# EAGLE design calbi (EAGLE 7.5.0)
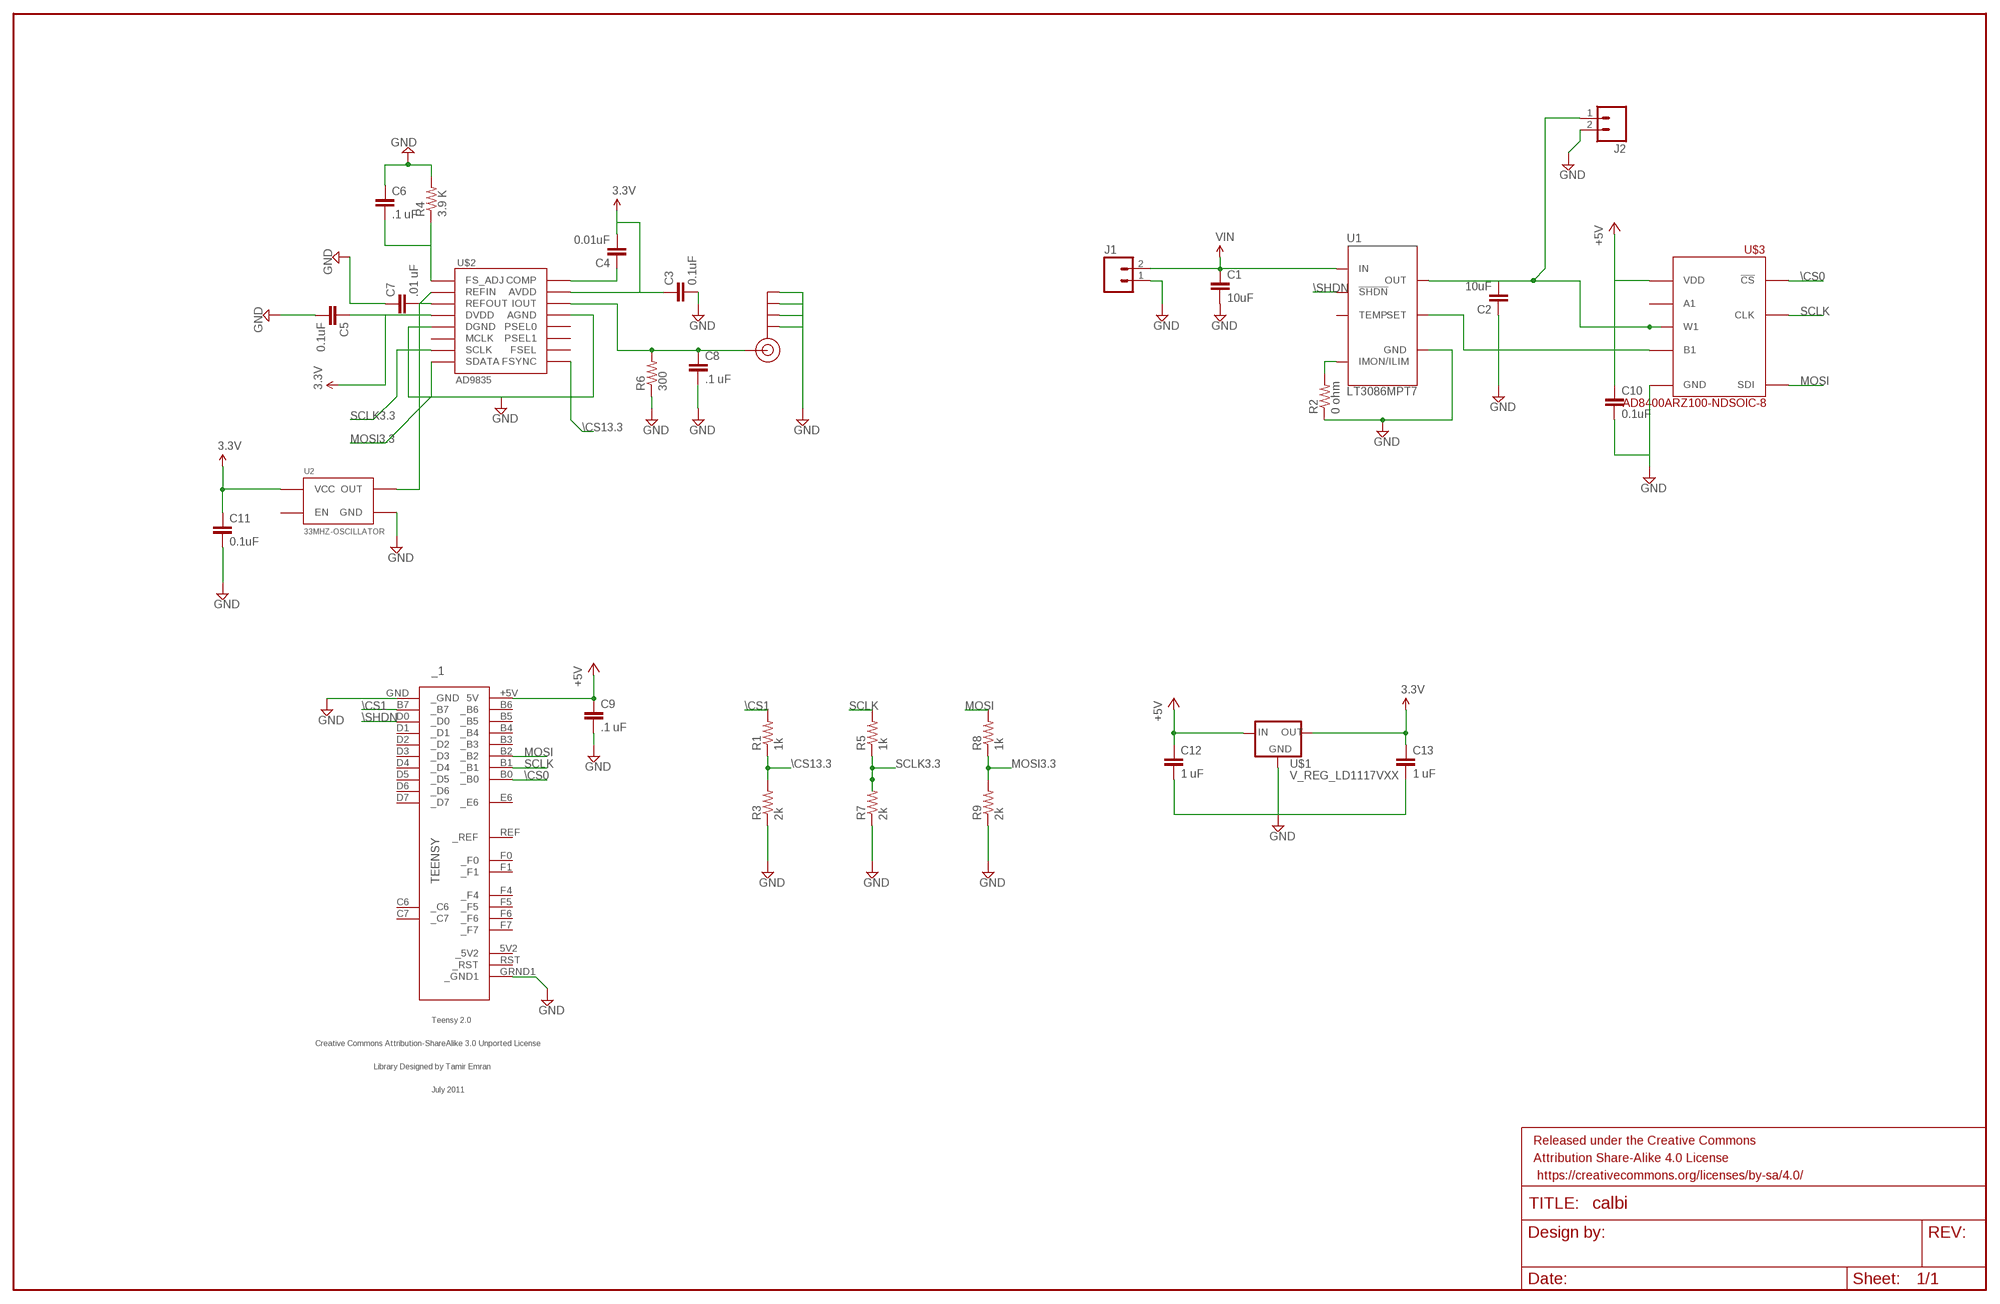
[diagram p0: schematic, sheet 1]

## Parts
_1  TEENSY  [TEENSY]
C1  10uF  CAP0603-CAP  [0603-CAP]
C2  10uF  CAP0603-CAP  [0603-CAP]
C3  0.1uF  CAP0603-CAP  [0603-CAP]
C4  0.01uF  CAP0603-CAP  [0603-CAP]
C5  0.1uF  CAP0603-CAP  [0603-CAP]
C6  .1 uF  CAP0603-CAP  [0603-CAP]
C7  .01 uF  CAP0603-CAP  [0603-CAP]
C8  .1 uF  CAP0603-CAP  [0603-CAP]
C9  .1 uF  CAP0603-CAP  [0603-CAP]
C10  0.1uF  CAP0603-CAP  [0603-CAP]
C11  0.1uF  CAP0603-CAP  [0603-CAP]
C12  1 uF  CAP0603-CAP  [0603-CAP]
C13  1 uF  CAP0603-CAP  [0603-CAP]
FRAME1  FRAME-LEDGER  [CREATIVE_COMMONS]
J1  M023.5MM  [SCREWTERMINAL-3.5MM-2]
J2  M023.5MM  [SCREWTERMINAL-3.5MM-2]
J$1  SMA_EDGE  [SMA-EDGE]
R1  1k  RESISTOR0603-RES  [0603-RES]
R2  0 ohm  RESISTOR0603-RES  [0603-RES]
R3  2k  RESISTOR0603-RES  [0603-RES]
R4  3.9 K  RESISTOR0603-RES  [0603-RES]
R5  1k  RESISTOR0603-RES  [0603-RES]
R6  300  RESISTOR0603-RES  [0603-RES]
R7  2k  RESISTOR0603-RES  [0603-RES]
R8  1k  RESISTOR0603-RES  [0603-RES]
R9  2k  RESISTOR0603-RES  [0603-RES]
U1  LT3086MPT7  [TO220-7]
U2  33MHZ-OSCILLATOR  [CRYSTAL-OSC-SMD-5X3.2]
U$1  V_REG_LD1117VXX  [78XXL]
U$2  AD9835  [TSSOP16]
U$3  AD8400ARZ100-NDSOIC-8  [SO08]

## Nets
3.3V: C3.1 C4.2 C5.1 C11.1 C13.1 U2.4(VCC) U$1.GND(OUT) U$2.4(DVDD) U$2.15(AVDD)
+5V: _1.+5V(5V) C9.1 C10.1 C12.1 U$1.OUT(IN) U$3.6(VDD)
\CS0: _1.B0(_B0) U$3.3(!CS)
\CS1: _1.B7(_B7) R1.2
\CS13.3: R1.1 R3.2 U$2.9(FSYNC)
\SHDN: _1.D0(_D0) U1.6(!SHDN)
GND: _1.GND(_GND) _1.GRND1(_GND1) C1.2 C2.1 C3.2 C5.2 C6.1 C7.1 C8.2 C9.2 C10.2 C11.2 C12.2 C13.2 J1.1 J2.2 J$1.GND@0(GND) J$1.GND@1(GND) J$1.GND@2(GND) J$1.GND@3(GND) R2.1 R3.1 R4.2 R6.1 R7.1 R9.1 U1.4(GND) U2.2(GND) U$1.IN(GND) U$2.5(DGND) U$2.13(AGND) U$3.2(GND)
MOSI: _1.B2(_B2) R8.2 U$3.4(SDI)
MOSI3.3: R8.1 R9.2 U$2.8(SDATA)
N$1: C7.2 U$2.3(REFOUT)
N$2: R2.2 U1.1(IMON/ILIM)
N$3: C8.1 J$1.SIG(SIGNAL) R6.2 U$2.14(IOUT)
N$4: C4.1 U$2.16(COMP)
N$5: C2.2 J2.1 U1.3(OUT) U$3.7(W1)
N$6: U2.3(OUT) U$2.2(REFIN)
N$7: C6.2 R4.1 U$2.1(FS_ADJ)
N$8: C1.1 J1.2 U1.5(IN)
N$10: U1.2(SET) U$3.1(B1)
SCLK: _1.B1(_B1) R5.2 U$3.5(CLK)
SCLK3.3: R5.1 R7.2 U$2.7(SCLK)
Unconnected: _1.5V2(_5V2) _1.B3(_B3) _1.B4(_B4) _1.B5(_B5) _1.B6(_B6) _1.C6(_C6) _1.C7(_C7) _1.D1(_D1) _1.D2(_D2) _1.D3(_D3) _1.D4(_D4) _1.D5(_D5) _1.D6(_D6) _1.D7(_D7) _1.E6(_E6) _1.F0(_F0) _1.F1(_F1) _1.F4(_F4) _1.F5(_F5) _1.F6(_F6) _1.F7(_F7) _1.REF(_REF) _1.RST(_RST) U1.7(TEMP) U2.1(EN) U$2.6(MCLK) U$2.10(FSEL) U$2.11(PSEL1) U$2.12(PSEL0) U$3.8(A1)

## Library data of the parts
_1 = calbi:TEENSY: Teensy 2.0 Original Design by Clint Fisher Modified Design by Tamir Emran Licensed Under Creative Commons Attribution-ShareAlike 3.0 Unported (CC BY-SA 3.0)
C1-C13 = SparkFun-Capacitors:CAP: Capacitor Standard 0603 ceramic capacitor, and 0.1" leaded capacitor.
FRAME1 = SparkFun-Aesthetics:FRAME-LEDGER: Schematic Frame Standard 11x14 US Ledger frame
J1 J2 = SparkFun-Connectors:M02: Standard 2-pin 0.1" header. Use with - straight break away headers ( PRT-00116) - right angle break away headers (PRT-00553) - swiss pins (PRT-00743) - machine pins (PRT-00117) - female headers (PRT-00115) Molex polarized connector foot print use with: PRT-08233 with associated crimp pins and housings. 2.54_SCREWTERM for use with PRT-10571. 3.5mm Screw Terminal footprints for PRT-08084 5mm Screw Terminal footprints for use with PRT-08432; PROD_ID: CONN-08399
J$1 = SparkFun-Connectors:SMA_EDGE: SMA Antenna Connector End launch SMA connector. The paste layer has been removed so that the connector can be hand soldered onto the board after reflow.
R1-R9 = SparkFun-Passives:RESISTOR: Resistor Basic schematic elements and footprints for 0603, 1206, and PTH resistors.
U1 = calbi:LT3086MPT7: The LT3086MPT7 is a 40V, 2.1A Low Dropout adjustable linear regulator with monitoring and cable drop compensation
U2 = SparkFun-FreqCtrl:33MHZ-OSCILLATOR: Generic 5x3.2 Oscillator; PROD_ID: XTAL-11986
U$1 = SparkFun-PowerIC:V_REG_LD1117VXX: LD1117VXX voltage regulator. We carry the 3.3V version (COM-00526) in TO-220 package.
U$2 = calbi:AD9835: 50MHz DDS waveform generator
U$3 = calbi:AD8400ARZ100-ND: The AD8400ARZ100-ND is a 1-channel digital potentiometer. This device provides a single variable resistor in SOIC-8 package up to 100K resistance

## Board
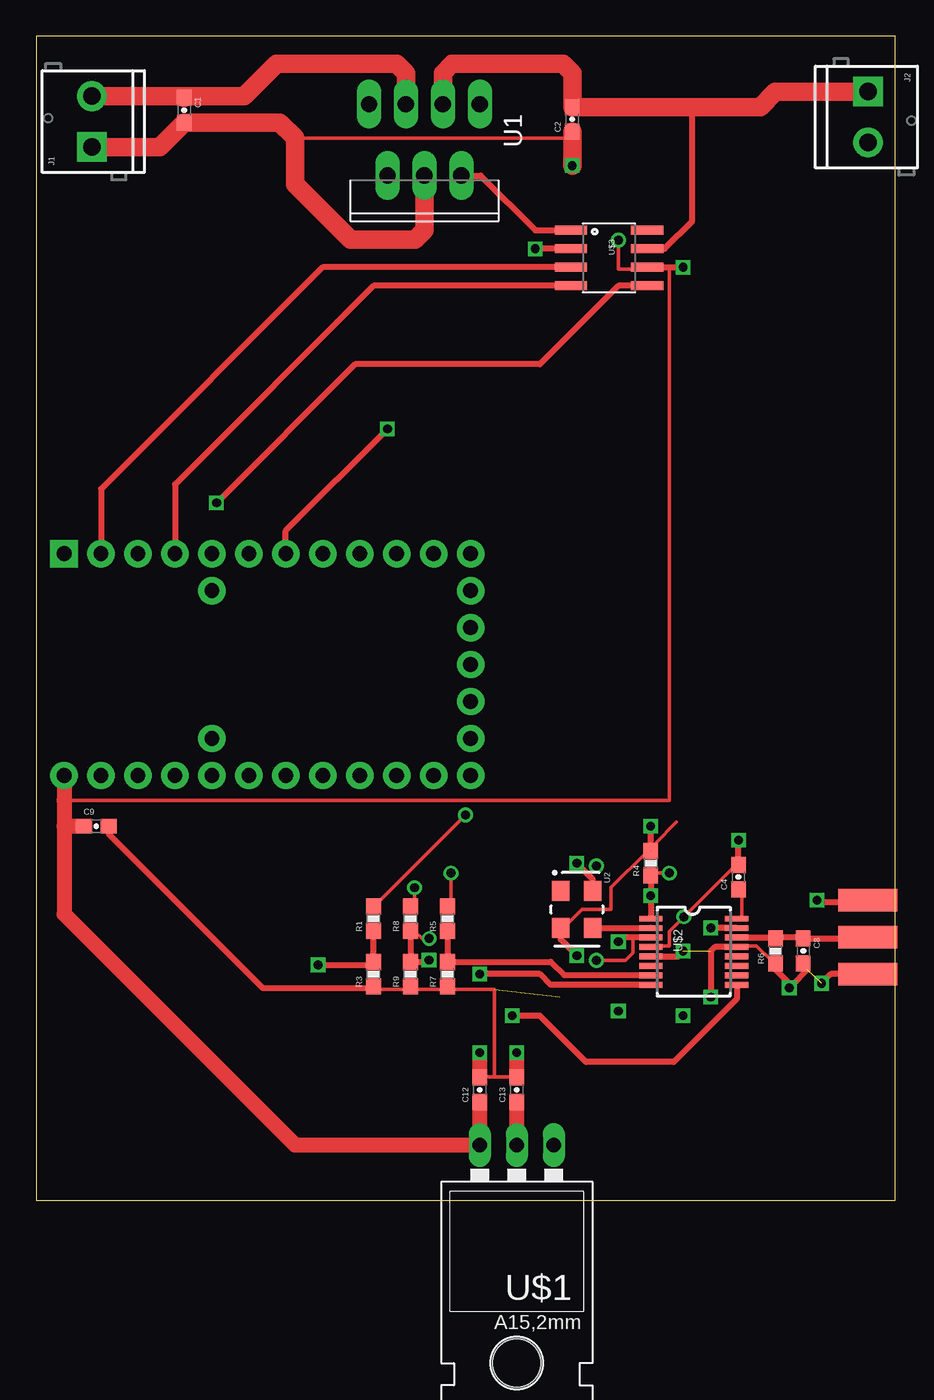
[diagram p1: board, top side]
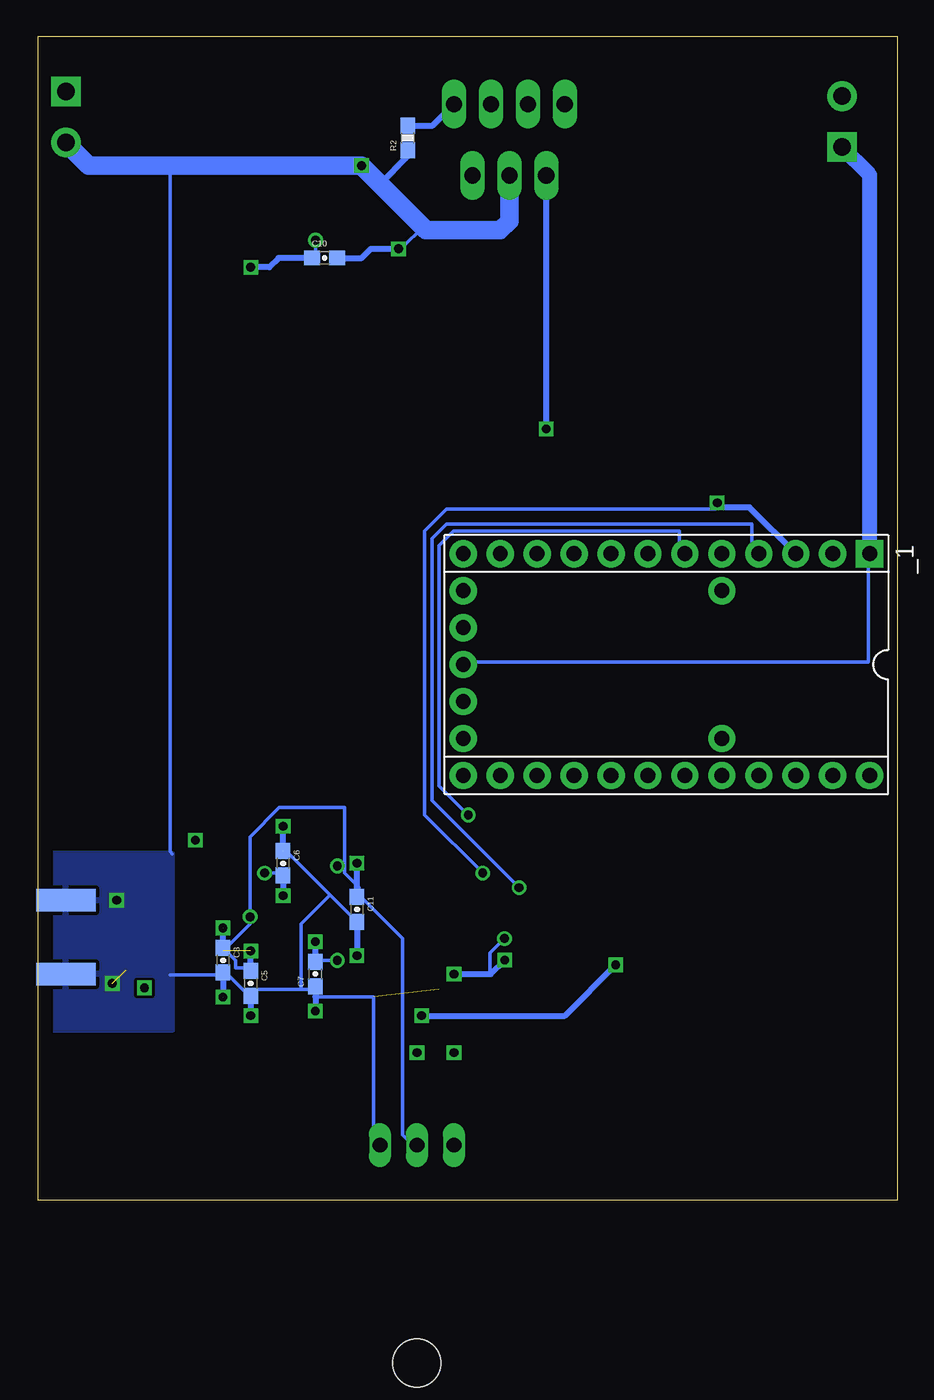
[diagram p2: board, bottom side, seen from below]

Size 59.04 x 80 mm. Coordinates in mm from the lower left corner, seen from the top.
Outline: 0,0 59.04,0 59.04,80 0,80 0,0
Copper layers (1*16): Top 0.035mm / dielectric 1.5mm / Bottom 0.035mm
Design rules "default": minimum track width 10mil, minimum drill 24mil, track to track 8mil, track to pad 8mil, pad to pad 8mil, via to via 8mil, smd to smd 8mil, copper to edge 40mil, drill to drill 8mil, minimum pad ring 10mil, minimum via ring 8mil, stop-mask expansion 4mil, vias tented up to drill 0mil, thermal gap 10mil

### Footprints (pad centres in the part's own frame; a part is rotated, then mirrored left to right if it is on the bottom)
TEENSY = drill 1.016 pad 1.88: 5V2 13.97,-2.54; +5V -13.97,7.62; B0 -11.43,-7.62; B1 -8.89,-7.62; B2 -6.35,-7.62; B3 -3.81,-7.62; B4 8.89,7.62; B5 6.35,7.62; B6 3.81,7.62; B7 -1.27,-7.62; C6 11.43,-7.62; C7 13.97,-7.62; D0 1.27,-7.62; D1 3.81,-7.62; D2 6.35,-7.62; D3 8.89,-7.62; D4 13.97,5.08; D5 13.97,-5.08; D6 13.97,7.62; D7 11.43,7.62; E6 -3.81,-5.08; F0 -11.43,7.62; F1 -8.89,7.62; F4 -6.35,7.62; F5 -3.81,7.62; F6 -1.27,7.62; F7 1.27,7.62; GRND1 13.97,0; REF -3.81,5.08; RST 13.97,2.54 | drill 1.016 pad 1.88 square: GND -13.97,-7.62
0603-CAP = smd 1.1 x 1: 1 -0.85,0; 2 0.85,0
SCREWTERMINAL-3.5MM-2 = drill 1.2 pad 2.032 square: 1 0,0 | drill 1.2 pad 2.032: 2 3.5,0
SMA-EDGE = smd 1.524 x 4.064: GND@0 0,0; GND@1 5.08,0; SIG 2.54,0 | smd 1.524 x 4.064 bottom: GND@2 0,0; GND@3 5.08,0
0603-RES = smd 1.1 x 1: 1 -0.85,0; 2 0.85,0
TO220-7 = drill 1.118 pad 1.626 long: 1 -3.81,-8.036; 2 -2.54,-3.126; 3 -1.27,-8.036; 4 0,-3.126; 5 1.27,-8.036; 6 2.54,-3.126; 7 3.81,-8.036; 8 -2.54,-3.126; 9 0,-3.126; 10 3.81,-8.036; 11 -1.27,-8.036; 12 -3.81,-8.036; 13 1.27,-8.036; 14 2.54,-3.126
CRYSTAL-OSC-SMD-5X3.2 = smd 1.397 x 1.194: 1 -1.27,-1.1; 2 1.27,-1.1; 3 1.27,1.1; 4 -1.27,1.1
78XXL = drill 1.016 long: GND 0,-3.81; IN -2.54,-3.81; OUT 2.54,-3.81 | hole 3.302: 0,11.176
TSSOP16 = smd 0.4 x 1.6: 1 -2.225,-2.85; 2 -1.575,-2.85; 3 -0.925,-2.85; 4 -0.275,-2.85; 5 0.375,-2.85; 6 1.025,-2.85; 7 1.675,-2.85; 8 2.325,-2.85; 9 2.325,3.05; 10 1.675,3.05; 11 1.025,3.05; 12 0.375,3.05; 13 -0.275,3.05; 14 -0.925,3.05; 15 -1.575,3.05; 16 -2.225,3.05
SO08 = smd 0.61 x 2.21: 1 -1.905,-2.616; 2 -0.635,-2.616; 3 0.635,-2.616; 4 1.905,-2.616; 5 1.905,2.616; 6 0.635,2.616; 7 -0.635,2.616; 8 -1.905,2.616

### Placement (x,y rotation side)
_1  15.88,36.83 180 bottom
C1  10.16,74.93 270 top
C2  36.83,74.3 90 top
C3  46.35,16.51 270 bottom
C4  48.26,22.23 90 top
C5  44.45,14.92 270 bottom
C6  42.23,23.18 270 bottom
C7  40.01,15.56 90 bottom
C8  52.7,17.14 270 top
C9  4.13,25.72 0 top
C10  39.37,64.77 0 bottom
C11  37.15,20 270 bottom
C12  30.48,7.62 90 top
C13  33.02,7.62 90 top
FRAME1  -101.6,52.07 0 top  (outside the outline)
J1  3.81,72.39 90 top
J2  57.15,76.2 270 top
J$1  57.15,15.56 90 top
R1  23.18,19.37 90 top
R2  33.66,73.03 90 bottom
R3  23.18,15.56 90 top
R4  42.23,23.18 90 top
R5  28.26,19.37 90 top
R6  50.8,17.14 90 top
R7  28.26,15.56 90 top
R8  25.72,19.37 90 top
R9  25.72,15.56 90 top
U1  26.67,67.31 180 top
U2  37.15,20 270 top
U$1  33.02,0 180 top
U$2  45.09,17.14 270 top
U$3  39.37,64.77 270 top

### Tracks (layer width: path | path; a pad name or v marks a point on that pad's centre or on a via)
3.3V  (via drill 0.61)  (1 unrouted)
  Top 0.254: C4.2 48,23 v44.5,19.5 43.5,18.5 43.5,17.5 42.5,17.5 U$2.4 | v38.5,23 37.91,22.41
  Top 0.406: U2.4 38.25,22.08 37.91,22.41 37.15,23.18 | U$2.15 46.37,18.72 46.35,18.73 | C4.2 48.26,24.77
  Top 1.016: U$1.GND C13.1
  Bottom 0.254: C5.1 44.5,16 45.5,16 45.5,16.5 46,17 C3.1 46,17.5 44.5,19 v44.5,19.5 44.5,25 42.5,27 38,27 38,23 | 38,23 38,22.5 37,21.5 37.15,21.5 | 38,23 v38.5,23 | U$1.GND 33.5,4 34,4.5 34,18 37,21 C11.1
  Bottom 0.406: C11.1 37.15,21.5 37.15,23.18 | C3.1 46.35,18.73 | C5.1 44.45,17.14
+5V  (via drill 0.61)
  Top 0.254: v40,66 40,64 41.5,64 U$3.6 | 43.5,64.14 43.5,27.5 1.91,27.5
  Top 0.406: U$3.6 43.5,64.14 44.45,64.14
  Top 1.016: C12.1 U$1.OUT 17.78,3.81 1.91,19.68 1.91,25.72 | _1.+5V 1.91,27.5 1.91,25.72 | C9.1 1.91,25.72
  Bottom 0.254: v40,66 40,65 C10.1
  Bottom 0.406: C10.1 42.55,64.77 43.18,64.14 44.45,64.14
\CS0
  Top 0.406: U$3.3 19.68,64.14 4.45,48.9 _1.B0
\CS1  (via drill 0.61)
  Top 0.254: v29.5,26.5 23.5,20.5 R1.2
  Bottom 0.254: v29.5,26.5 31.5,28.5 31.5,45 30.5,46 15,46 15,44.5 _1.B7
\CS13.3  (via drill 0.6)
  Top 0.406: R1.1 R3.2 22.96,16.19 v19.37,16.19 | U$2.9 48.13,13.85 43.81,9.53 37.78,9.53 34.61,12.7 v32.7,12.7
  Bottom 0.406: v32.7,12.7 22.86,12.7 v19.37,16.19
\SHDN  (via drill 0.6)
  Top 0.406: _1.D0 17.14,46.04 v24.13,53.02
  Bottom 0.406: v24.13,53.02 U1.6
GND  (via drill 0.6)  (5 unrouted)
  Top 0.254: C2.1 36.5,73 18,73 17.78,73.03 | U2.2 36.5,19 37.5,20 39.5,20 39.5,21.5 42,24 R4.2 42.5,24.5 44,26 | 56,20.5 J$1.GND@1 57.5,20.5 | R6.1 50.5,16.5 49.5,17.5 48.5,17.5 U$2.13 | 53,16 C8.2 | 57,16 J$1.GND@0 57.5,16 | 31.5,8.5 33,8.5 C13.2 | 31.5,8.5 30.5,8.5 C12.2 | R3.1 23.5,14.5 25.5,14.5 R9.1 26,14.5 28,14.5 R7.1 28.5,14.5 31.5,14.5 31.5,8.5
  Top 0.406: U$3.2 v34.29,65.41 | U2.2 36.05,17.93 37.15,16.83 | U$2.13 46.63,17.42 46.35,17.14 46.35,13.97 | R4.2 42.23,25.72 | U$2.5 44.08,16.77 44.45,17.14 | C9.2 4.98,25.18 15.56,14.61 23.07,14.61 R3.1 | 57.5,20.5 53.8,20.5 v53.66,20.64 | 53,16 53,15.85 51.91,14.76 | 51.91,14.76 51.75,14.61 | R6.1 50.8,15.88 51.91,14.76 | J$1.GND@0 54.61,15.56 v53.98,14.92
  Top 1.016: C12.2 30.48,10.16 | C13.2 33.02,10.16
  Top 1.27: J1.1 8.47,72.39 C1.2 16.73,74.08 17.78,73.03 17.78,69.85 21.59,66.04 26.04,66.04 26.67,66.67 U1.4 | C2.1 36.83,71.12
  Bottom 0.254: 32.6,66.89 34,65.5 v34.29,65.41 | _1.GRND1 29.5,37 2,37 2,44 _1.GND | 39,21 37.5,19.5 C11.2 | 39,21 42,24 R4.2 | 41,14.5 40.5,14.5 C7.1 | 41,14.5 44,14.5 C5.2 44.5,14 46,15.5 C3.2 46.5,15.5 50,15.5 | 39,21 41,19 41,14.5 | 40.01,14 36,14 36,4 U$1.IN | 50,71.12 50,24 49.85,23.81
  Bottom 0.406: C10.2 36.83,64.77 36.2,65.41 v34.29,65.41 | C11.2 37.15,16.83 | C3.2 46.35,13.97 | R4.2 42.23,25.72 | R2.1 33.66,71.75 35.56,69.85 | C5.2 44.45,12.7 | C7.1 40.01,14 40.01,13.02
  Bottom 1.016: _1.GND 1.91,70.48 J1.1
  Bottom 1.27: U1.4 26.67,67.31 27.3,66.67 32.38,66.67 32.6,66.89 35.56,69.85 36.83,71.12 50,71.12 55.57,71.12 J2.2
  pour Bottom: 59.05,23.81 59.05,11.75 49.85,11.75 49.85,23.81
MOSI  (via drill 0.61)
  Top 0.254: v26,21.5 26,20.5 R8.2
  Top 0.406: U$3.4 23.18,62.87 9.53,49.21 9.53,45.09 9.84,44.77 _1.B2
  Bottom 0.254: v26,21.5 32,27.5 32,45.5 31,46.5 10,46.5 10,44.5 _1.B2
MOSI3.3  (via drill 0.6, 0.61)
  Top 0.254: v27,18 26.5,18 26,18.5 R8.1
  Top 0.406: R8.1 R9.2 26.89,16.41 26.99,16.51 | U$2.8 35.34,14.82 34.61,15.56 v30.48,15.56
  Bottom 0.254: v27,18 28,17 28,15.5 27.94,15.56
  Bottom 0.406: v30.48,15.56 27.94,15.56 26.99,16.51
N$1  (via drill 0.61)
  Top 0.254: v38.5,16.5 40.5,16.5 41,17 41,18.07
  Top 0.406: U$2.3 41,18.07 40.3,18.07 40.01,17.78
  Bottom 0.254: v38.5,16.5 40,16.5 C7.2
  Bottom 0.406: C7.2 40.01,17.78
N$2
  Bottom 0.406: R2.2 31.95,73.88 U1.1
N$3
  Top 0.254: 56.3,18 56.5,18 57,18 J$1.SIG
  Top 0.406: R6.2 50.73,18.07 U$2.14 50.77,18.07 50.8,18.1 52.6,18.1 C8.1 56.3,18 56.52,17.78
N$4
  Top 0.254: C4.1 48.5,21 48.5,19.5 U$2.16
N$5
  Top 0.406: U$3.7 43.18,65.41 45.09,67.31 45.09,75.14
  Top 1.27: U1.3 27.94,77.47 28.57,78.11 36.2,78.11 36.83,77.47 C2.2 45.09,75.14 49.74,75.14 50.8,76.2 J2.1
N$6
  Top 0.406: U2.3 42.22,18.73 U$2.2
N$7  (via drill 0.61)
  Top 0.254: v43.5,22.5 42.5,22.5 C6.2
  Top 0.406: C6.2 U$2.1
  Bottom 0.254: v43.5,22.5 42.5,22.5 C6.2
  Bottom 0.406: C6.2 42.23,20.95
N$8
  Top 1.27: C1.1 10.05,75.89 J1.2 14.29,75.89 16.51,78.11 24.77,78.11 25.4,77.47 U1.5
N$9  (via drill 0.6)
  other vias: 40.01,17.78
N$10
  Top 0.406: U1.2 30.53,70.44 34.29,66.67 U$3.1
N$11
  Bottom 0.406: 40.64,64.77 41.91,64.77
N$12  (via drill 0.6)
  other vias: 40.01,13.02
N$13  (via drill 0.6)
  other vias: 26.99,16.51
N$14  (via drill 0.6)
  other vias: 44.45,64.14
N$17  (via drill 0.6)
  other vias: 36.83,71.12
N$18  (via drill 0.6)
  other vias: 30.48,10.16
N$19  (via drill 0.6)
  other vias: 33.02,10.16
N$21  (via drill 0.6)
  other vias: 51.75,14.61
N$24  (via drill 0.6)
  other vias: 37.15,16.83
N$25  (via drill 0.6)
  other vias: 37.15,23.18
N$26  (via drill 0.6)
  other vias: 46.35,18.73
N$27  (via drill 0.6)
  other vias: 46.35,13.97
N$28  (via drill 0.6)
  other vias: 42.23,20.95
N$29  (via drill 0.6)
  other vias: 42.23,25.72
N$30  (via drill 0.6)
  other vias: 48.26,24.77
N$32  (via drill 0.6)
  other vias: 44.45,17.14
N$33  (via drill 0.6)
  other vias: 44.45,12.7
SCLK  (via drill 0.6, 0.61)
  Top 0.254: v28.5,22.5 28.5,20.5 R5.2
  Top 0.406: U$3.5 40.01,62.87 34.61,57.47 21.91,57.47 v12.38,47.94
  Bottom 0.254: v28.5,22.5 32.5,26.5 32.5,46 31,47.5 12.5,47.5 v12.38,47.94
  Bottom 0.406: _1.B1 10.16,47.62 12.06,47.62 v12.38,47.94
SCLK3.3
  Top 0.406: R5.1 28.57,18.52 28.57,18.41 28.26,18.41 R7.2 35.34,16.41 36.28,15.47 U$2.7